# EAGLE design GBA_AIO_Matrix (EAGLE 6.6.0)

## Sheet 1 of 4
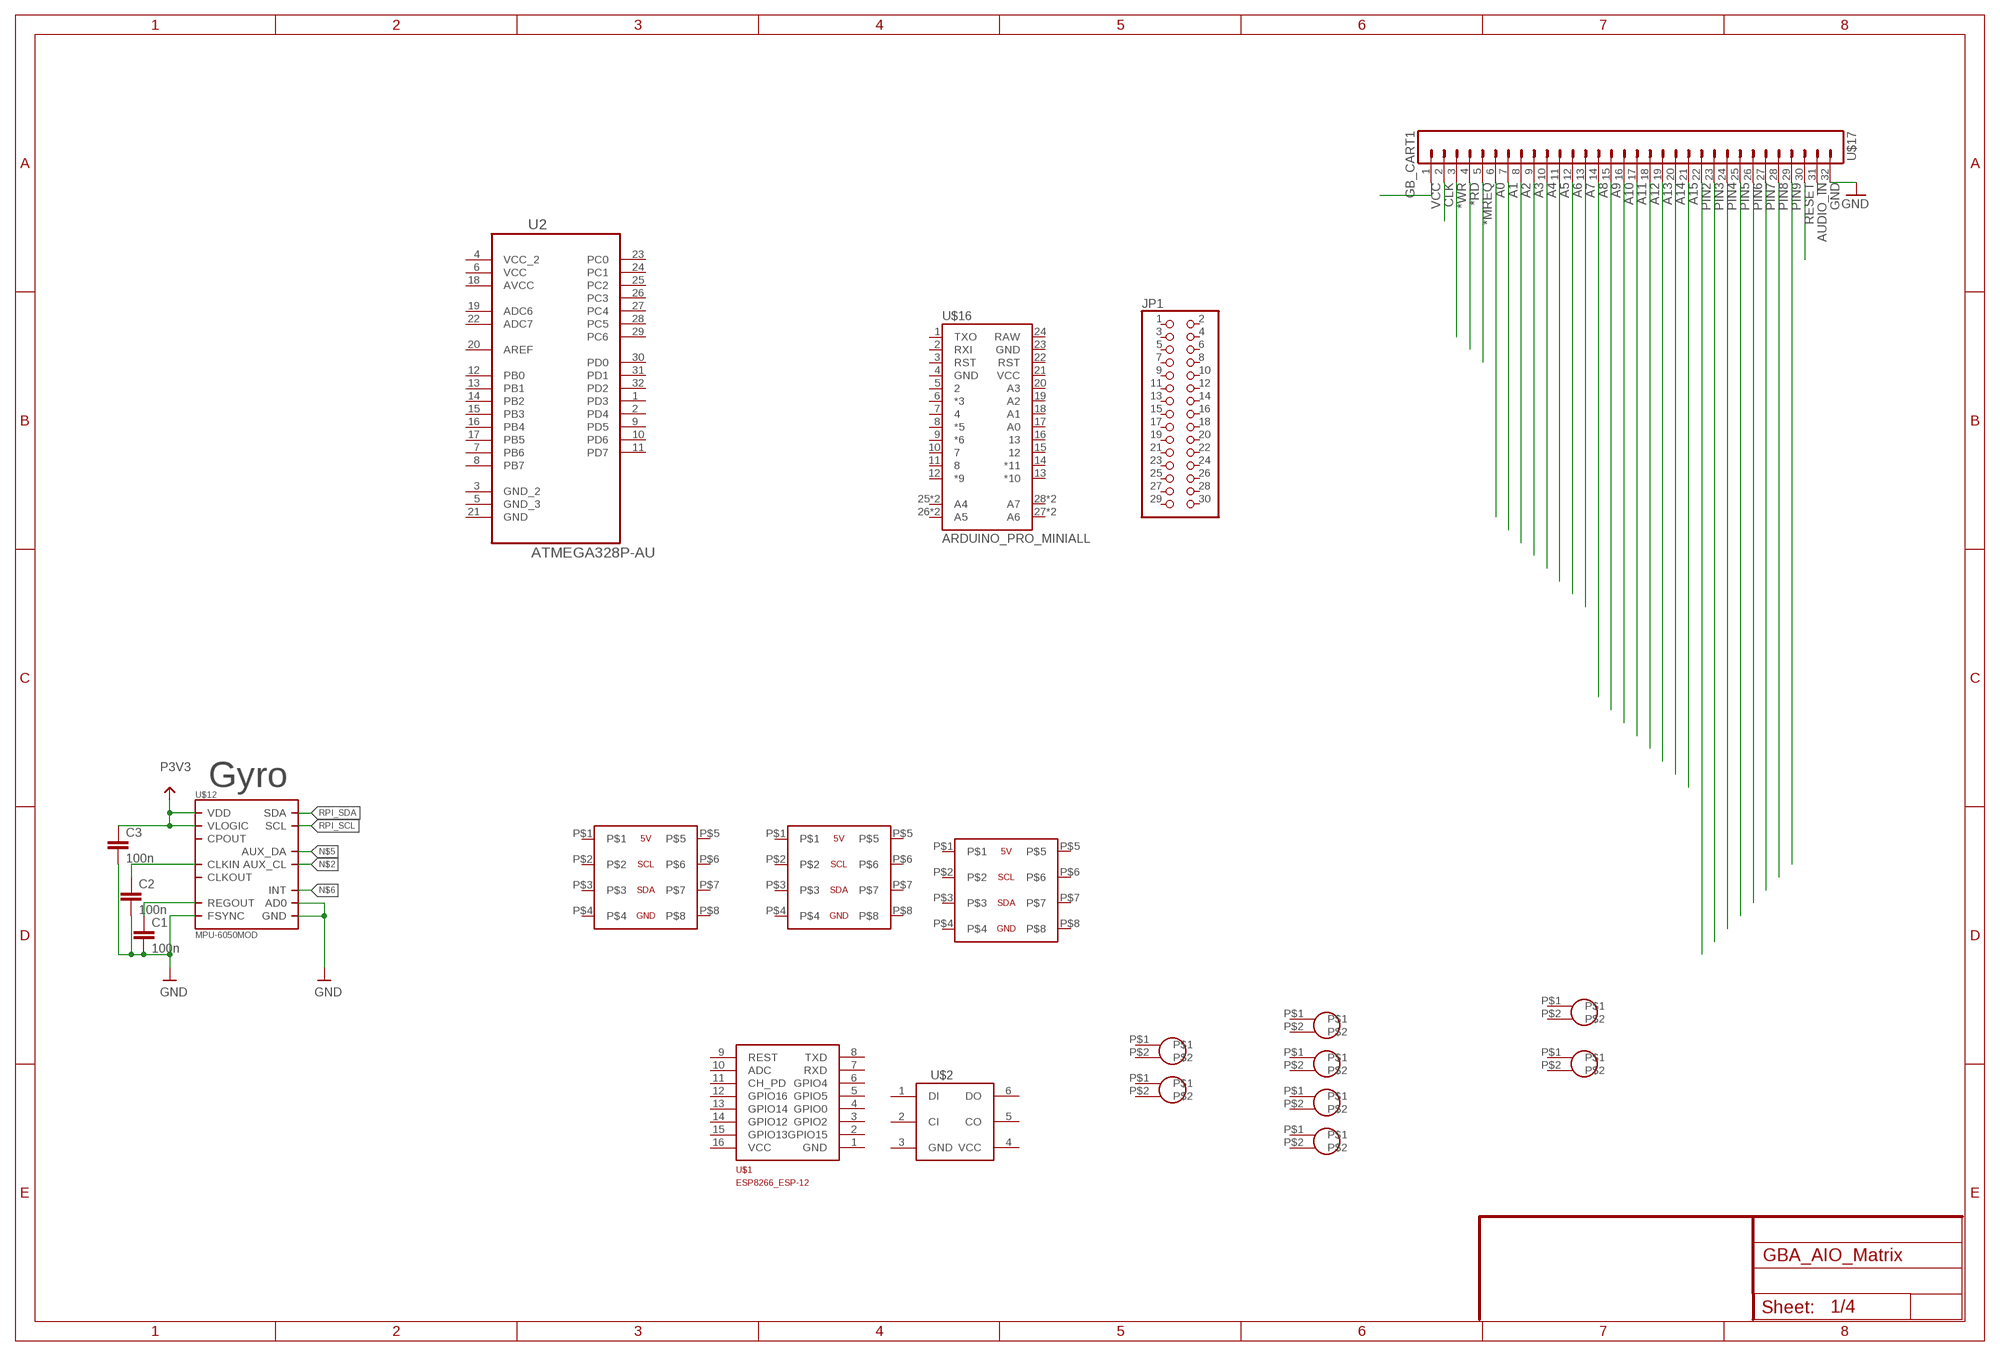
[diagram p0: schematic, sheet 1]

### Parts
C1  100n  C-EUC0603  [C0603]
C2  100n  C-EUC0603  [C0603]
C3  100n  C-EUC0603  [C0603]
JP1  PINHD-2X15/90  [2X15/90]
U2  ATMEGA328P-AU  [QFP80P900X900X120-32N]
U$1  ESP8266_ESP-12  [ESP8266-ESP12]
U$2  APA102  [LED5050]
U$4  GBA_BUTTONAB  [GBA_AB]
U$5  GBA_BUTTONAB  [GBA_AB]
U$6  GBA_BUTTONDIREKTION  [GBA_DIREKTION]
U$7  GBA_BUTTONDIREKTION  [GBA_DIREKTION]
U$8  GBA_BUTTONDIREKTION  [GBA_DIREKTION]
U$9  GBA_BUTTONDIREKTION  [GBA_DIREKTION]
U$10  GBA_BUTTONSTART  [GBA_START]
U$11  GBA_BUTTONSTART  [GBA_START]
U$12  MPU-6050MOD  [QFN.24.4X4.MOD]
U$16  ARDUINO_PRO_MINIALL  [ARDUINO_PRO_MINI]
U$17  GB_CART1  [GB_CART_1]
U$18  DEBAUER_18X6MATRIX  [DEBAUER_16X8MATRIX]
U$19  DEBAUER_18X6MATRIX  [DEBAUER_16X8MATRIX]
U$20  DEBAUER_18X6MATRIX  [DEBAUER_16X8MATRIX]

### Nets
*MREQ: U$17.5
*RD: U$17.4
*WR: U$17.3
A0: U$17.6 ; also sheet 4
A1: U$17.7 ; also sheet 4
A2: U$17.8 ; also sheet 4
A3: U$17.9
A4: U$17.10
A5: U$17.11
A6: U$17.12
A7: U$17.13
A8: U$17.14
A9: U$17.15
A10: U$17.16
A11: U$17.17
A12: U$17.18
A13: U$17.19
A14: U$17.20
A15: U$17.21
AUDIO_IN: U$17.31
GND: C1.2 C2.2 C3.2 U$12.9(AD0) U$12.11(FSYNC) U$12.18(GND) U$17.2 U$17.32 ; also sheet 2,3,4
N$1: C2.1 U$12.1(CLKIN)
N$2: U$12.7(AUX_CL)
N$3: C1.1 U$12.10(REGOUT)
N$5: U$12.6(AUX_DA)
N$6: U$12.12(INT)
P3V3: C3.1 U$12.8(VLOGIC) U$12.13(VDD) ; also sheet 2,3,4
PIN2: U$17.22
PIN3: U$17.23
PIN4: U$17.24
PIN5: U$17.25
PIN6: U$17.26
PIN7: U$17.27
PIN8: U$17.28
PIN9: U$17.29
RPI_SCL: U$12.23(SCL)
RPI_SDA: U$12.24(SDA)
VCC1: U$17.1 U$17.30
Unconnected: JP1.1 JP1.2 JP1.3 JP1.4 JP1.5 JP1.6 JP1.7 JP1.8 JP1.9 JP1.10 JP1.11 JP1.12 JP1.13 JP1.14 JP1.15 JP1.16 JP1.17 JP1.18 JP1.19 JP1.20 JP1.21 JP1.22 JP1.23 JP1.24 JP1.25 JP1.26 JP1.27 JP1.28 JP1.29 JP1.30 U2.1(PD3) U2.2(PD4) U2.3(GND_2) U2.5(GND_3) U2.7(PB6) U2.8(PB7) U2.9(PD5) U2.10(PD6) U2.11(PD7) U2.12(PB0) U2.13(PB1) U2.14(PB2) U2.15(PB3) U2.16(PB4) U2.17(PB5) U2.19(ADC6) U2.20(AREF) U2.21(GND) U2.22(ADC7) U2.23(PC0) U2.24(PC1) U2.25(PC2) U2.26(PC3) U2.27(PC4) U2.28(PC5) U2.29(PC6) U2.30(PD0) U2.31(PD1) U2.32(PD2) U$1.1(GND) U$1.2(GPIO15) U$1.3(GPIO2) U$1.4(GPIO0) U$1.5(GPIO5) U$1.6(GPIO4) U$1.7(RXD) U$1.8(TXD) U$1.9(REST) U$1.10(ADC) U$1.11(CH_PD) U$1.12(GPIO16) U$1.13(GPIO14) U$1.14(GPIO12) U$1.15(GPIO13) U$1.16(VCC) U$2.1(DI) U$2.2(CI) U$2.3(GND) U$2.4(VCC) U$2.5(CO) U$2.6(DO) U$4.P$1 U$4.P$2 U$5.P$1 U$5.P$2 U$6.P$1 U$6.P$2 U$7.P$1 U$7.P$2 U$8.P$1 U$8.P$2 U$9.P$1 U$9.P$2 U$10.P$1 U$10.P$2 U$11.P$1 U$11.P$2 U$12.20(CPOUT) U$12.22(CLKOUT) U$16.1(TXO) U$16.2(RXI) U$16.3(RST) U$16.4(GND) U$16.5 U$16.6(*3) U$16.7 U$16.8(*5) U$16.9(*6) U$16.10 U$16.11 U$16.12(*9) U$16.13(*10) U$16.14(*11) U$16.15 U$16.16 U$16.17(A0) U$16.18(A1) U$16.19(A2) U$16.20(A3) U$16.21(VCC) U$16.22(RST) U$16.23(GND) U$16.24(RAW) U$16.25(A4) U$16.26(A5) U$16.27(A6) U$16.28(A7) U$16.A4 U$16.A5 U$16.A6 U$16.A7 U$18.P$1 U$18.P$2 U$18.P$3 U$18.P$4 U$18.P$5 U$18.P$6 U$18.P$7 U$18.P$8 U$19.P$1 U$19.P$2 U$19.P$3 U$19.P$4 U$19.P$5 U$19.P$6 U$19.P$7 U$19.P$8 U$20.P$1 U$20.P$2 U$20.P$3 U$20.P$4 U$20.P$5 U$20.P$6 U$20.P$7 U$20.P$8

### Notes on the sheet
- VCC | CLK | RESET
- Gyro

## Sheet 2 of 4
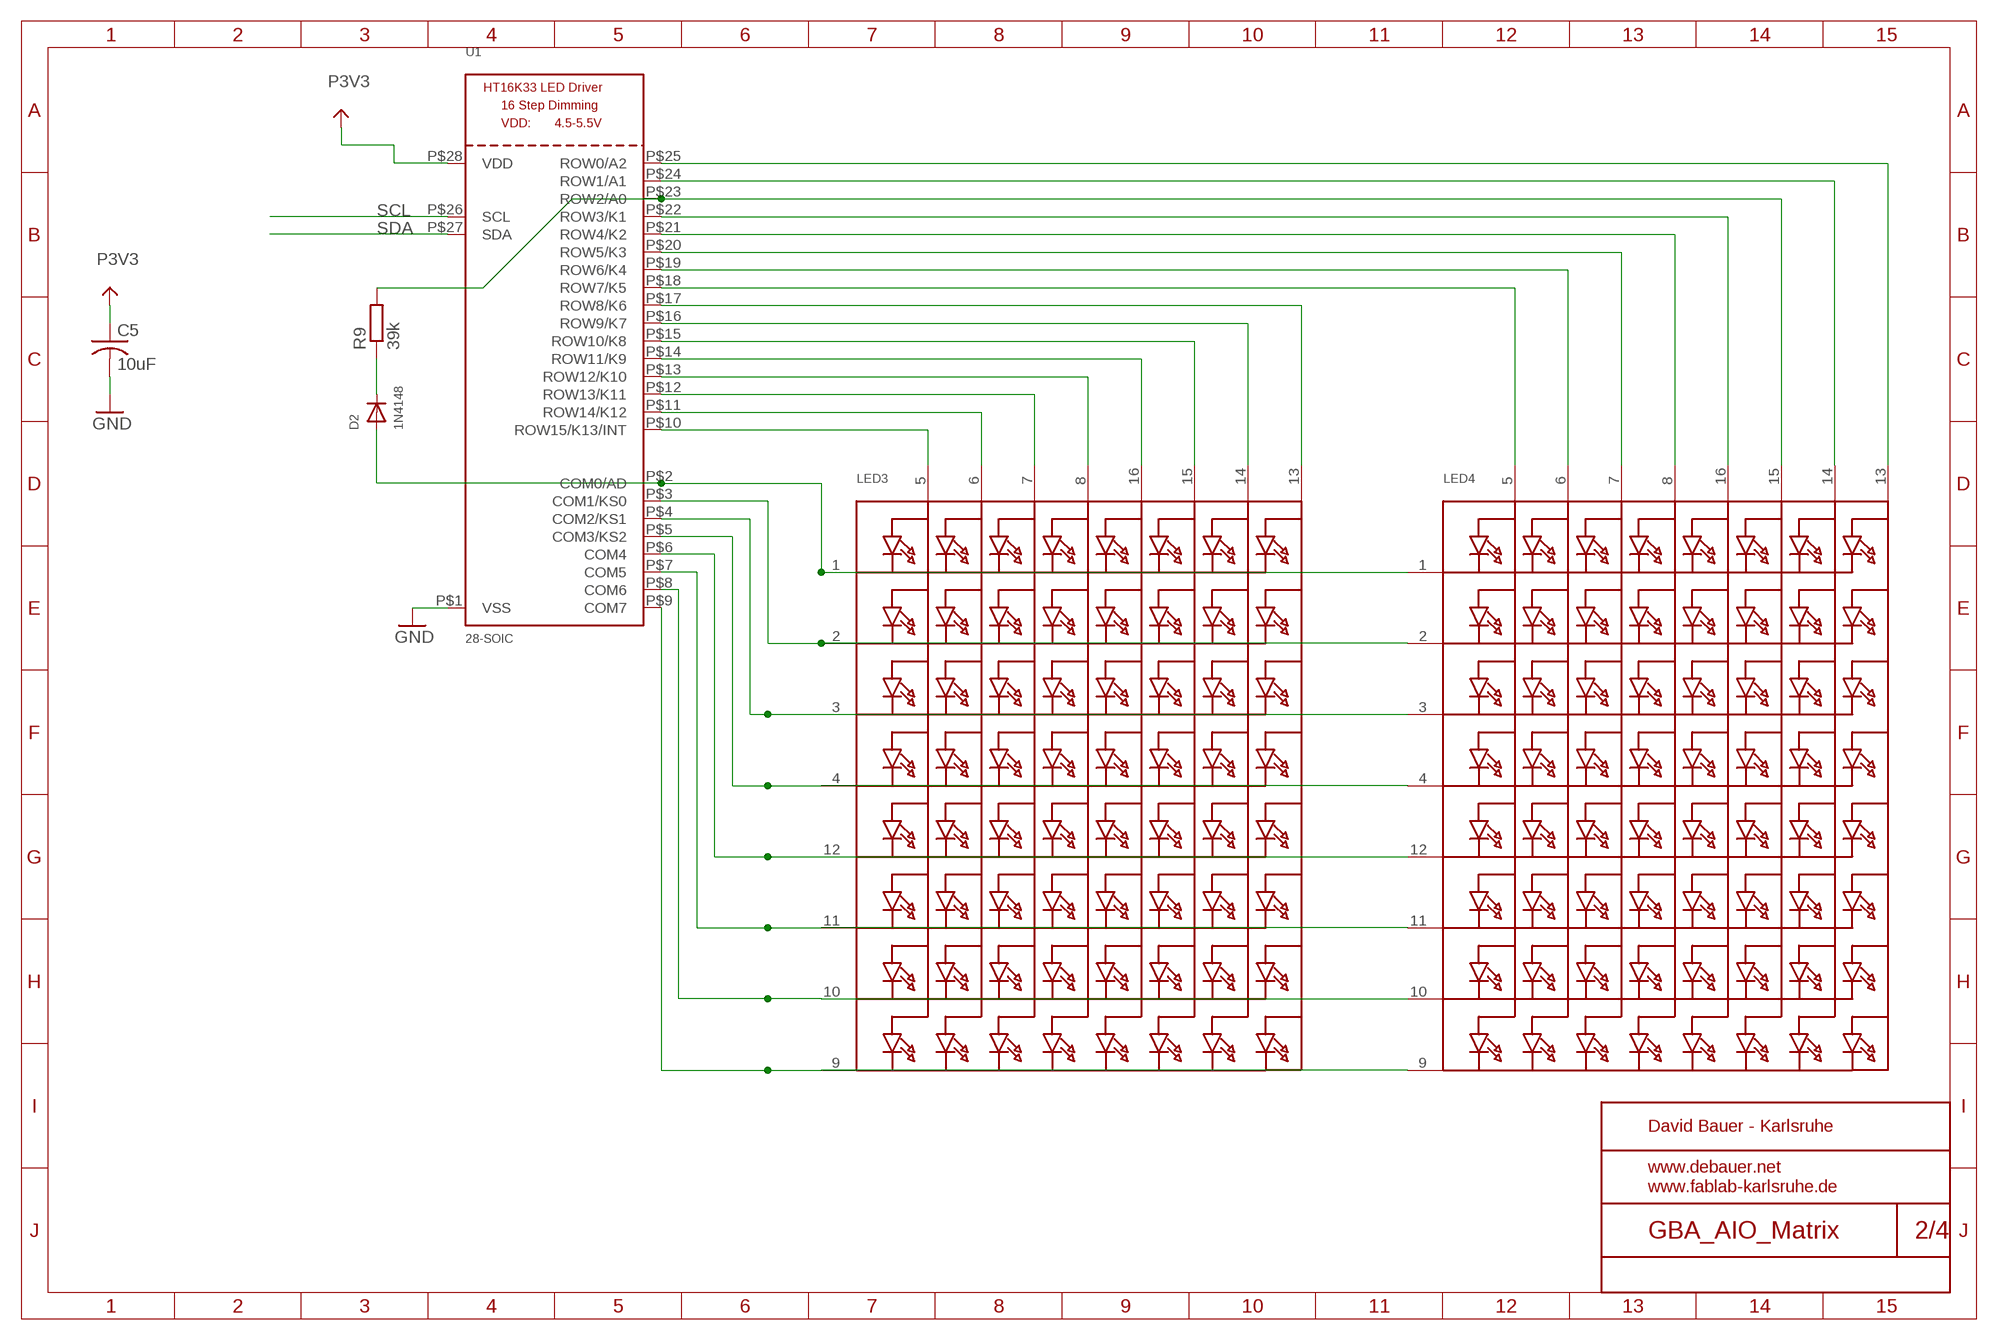
[diagram p1: schematic, sheet 2]

### Parts
C5  10uF  C-USC0805  [C0805]
D2  1N4148  DIODESOD-323F  [SOD-323F]
LED3  SEGMENT_8X8_ROWCATHODE  [SEGMENT_BL-M07C881UR]
LED4  SEGMENT_8X8_ROWCATHODE  [SEGMENT_BL-M07C881UR]
R9  39k  R-EU_R0805  [R0805]
U1  28-SOIC  HT16K33_SOP28  [SOP28_300MIL]

### Nets
GND: C5.2 U1.P$1(VSS) ; also sheet 1,3,4
N$4: LED4.13(A8) U1.P$25(ROW0/A2)
N$7: LED4.15(A6) R9.2 U1.P$23(ROW2/A0)
N$8: LED4.14(A7) U1.P$24(ROW1/A1)
N$12: LED3.9(K8) LED4.9(K8) U1.P$9(COM7)
N$13: LED3.10(K7) LED4.10(K7) U1.P$8(COM6)
N$21: LED3.11(K6) LED4.11(K6) U1.P$7(COM5)
N$24: LED3.12(K5) LED4.12(K5) U1.P$6(COM4)
N$25: LED3.4(K4) LED4.4(K4) U1.P$5(COM3/KS2)
N$27: LED3.3(K3) LED4.3(K3) U1.P$4(COM2/KS1)
N$30: LED3.6(A2) U1.P$11(ROW14/K12)
N$31: LED3.7(A3) U1.P$12(ROW13/K11)
N$32: LED4.5(A1) U1.P$18(ROW7/K5)
N$33: LED4.8(A4) U1.P$21(ROW4/K2)
N$34: LED4.7(A3) U1.P$20(ROW5/K3)
N$35: LED3.13(A8) U1.P$17(ROW8/K6)
N$36: LED3.14(A7) U1.P$16(ROW9/K7)
N$37: LED3.16(A5) U1.P$14(ROW11/K9)
N$43: LED3.15(A6) U1.P$15(ROW10/K8)
N$44: LED3.8(A4) U1.P$13(ROW12/K10)
N$45: LED3.5(A1) U1.P$10(ROW15/K13/INT)
N$47: D2.C R9.1
N$48: LED4.16(A5) U1.P$22(ROW3/K1)
N$49: LED4.6(A2) U1.P$19(ROW6/K4)
N$50: D2.A LED3.1(K1) LED4.1(K1) U1.P$2(COM0/AD)
N$55: LED3.2(K2) LED4.2(K2) U1.P$3(COM1/KS0)
P3V3: C5.1 U1.P$28(VDD) ; also sheet 1,3,4
SCL: U1.P$26(SCL) ; also sheet 3,4
SDA: U1.P$27(SDA) ; also sheet 3,4

## Sheet 3 of 4
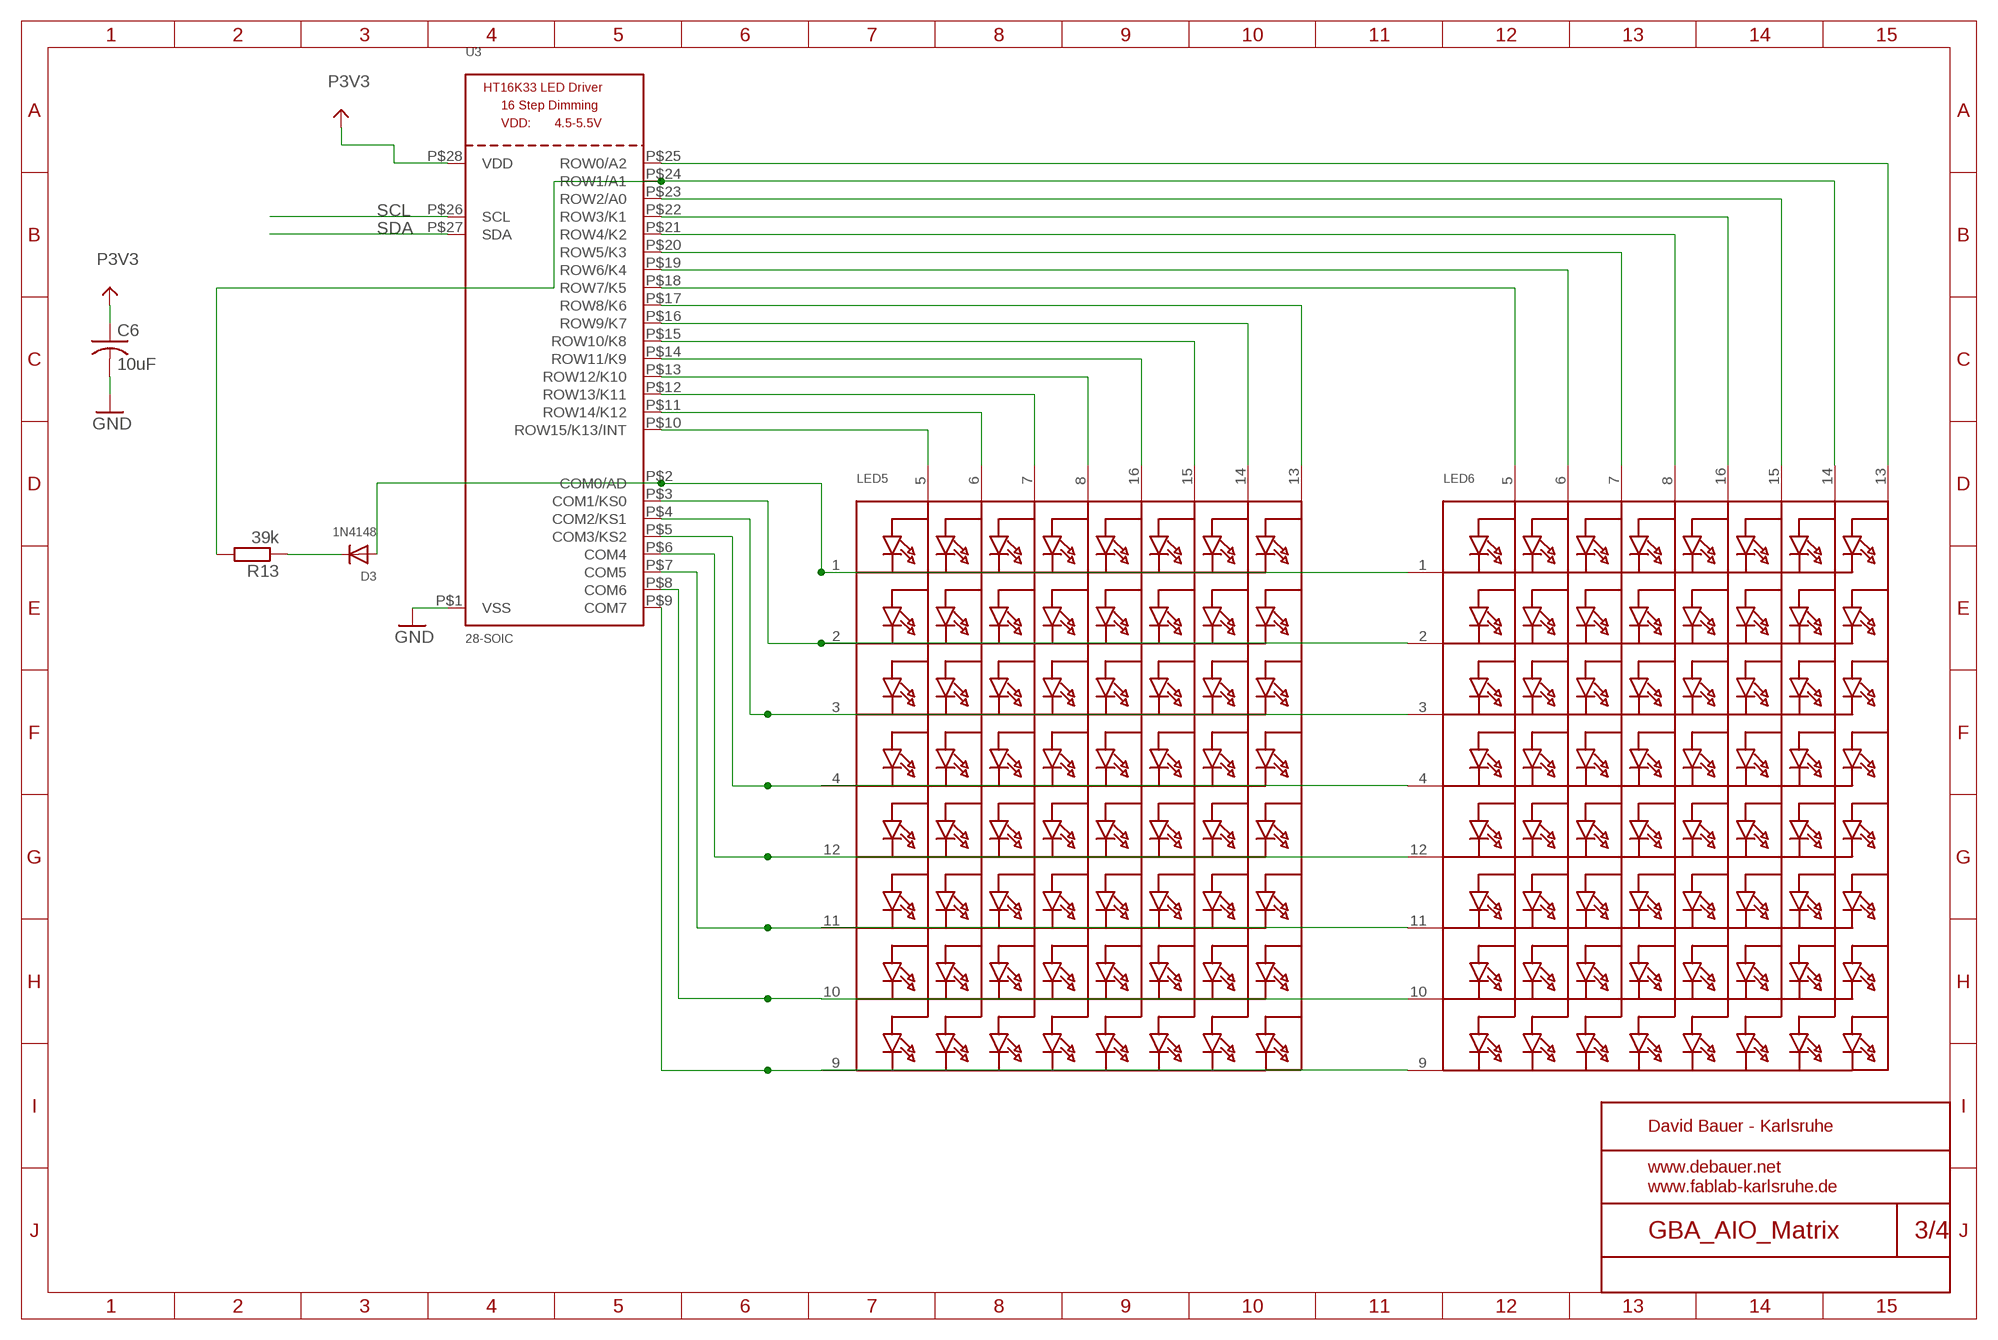
[diagram p2: schematic, sheet 3]

### Parts
C6  10uF  C-USC0805  [C0805]
D3  1N4148  DIODESOD-323F  [SOD-323F]
LED5  SEGMENT_8X8_ROWCATHODE  [SEGMENT_BL-M07C881UR]
LED6  SEGMENT_8X8_ROWCATHODE  [SEGMENT_BL-M07C881UR]
R13  39k  R-EU_R0805  [R0805]
U3  28-SOIC  HT16K33_SOP28  [SOP28_300MIL]

### Nets
GND: C6.2 U3.P$1(VSS) ; also sheet 1,2,4
N$9: LED6.13(A8) U3.P$25(ROW0/A2)
N$10: LED6.14(A7) R13.2 U3.P$24(ROW1/A1)
N$11: LED6.15(A6) U3.P$23(ROW2/A0)
N$56: LED5.9(K8) LED6.9(K8) U3.P$9(COM7)
N$57: LED5.10(K7) LED6.10(K7) U3.P$8(COM6)
N$58: LED5.11(K6) LED6.11(K6) U3.P$7(COM5)
N$59: LED5.12(K5) LED6.12(K5) U3.P$6(COM4)
N$60: LED5.4(K4) LED6.4(K4) U3.P$5(COM3/KS2)
N$61: LED5.3(K3) LED6.3(K3) U3.P$4(COM2/KS1)
N$64: LED5.6(A2) U3.P$11(ROW14/K12)
N$65: LED5.7(A3) U3.P$12(ROW13/K11)
N$66: LED6.5(A1) U3.P$18(ROW7/K5)
N$67: LED6.8(A4) U3.P$21(ROW4/K2)
N$68: LED6.7(A3) U3.P$20(ROW5/K3)
N$69: LED5.13(A8) U3.P$17(ROW8/K6)
N$70: LED5.14(A7) U3.P$16(ROW9/K7)
N$71: LED5.16(A5) U3.P$14(ROW11/K9)
N$72: LED5.15(A6) U3.P$15(ROW10/K8)
N$73: LED5.8(A4) U3.P$13(ROW12/K10)
N$74: LED5.5(A1) U3.P$10(ROW15/K13/INT)
N$76: D3.C R13.1
N$77: LED6.16(A5) U3.P$22(ROW3/K1)
N$78: LED6.6(A2) U3.P$19(ROW6/K4)
N$79: D3.A LED5.1(K1) LED6.1(K1) U3.P$2(COM0/AD)
N$80: LED5.2(K2) LED6.2(K2) U3.P$3(COM1/KS0)
P3V3: C6.1 U3.P$28(VDD) ; also sheet 1,2,4
SCL: U3.P$26(SCL) ; also sheet 2,4
SDA: U3.P$27(SDA) ; also sheet 2,4

## Sheet 4 of 4
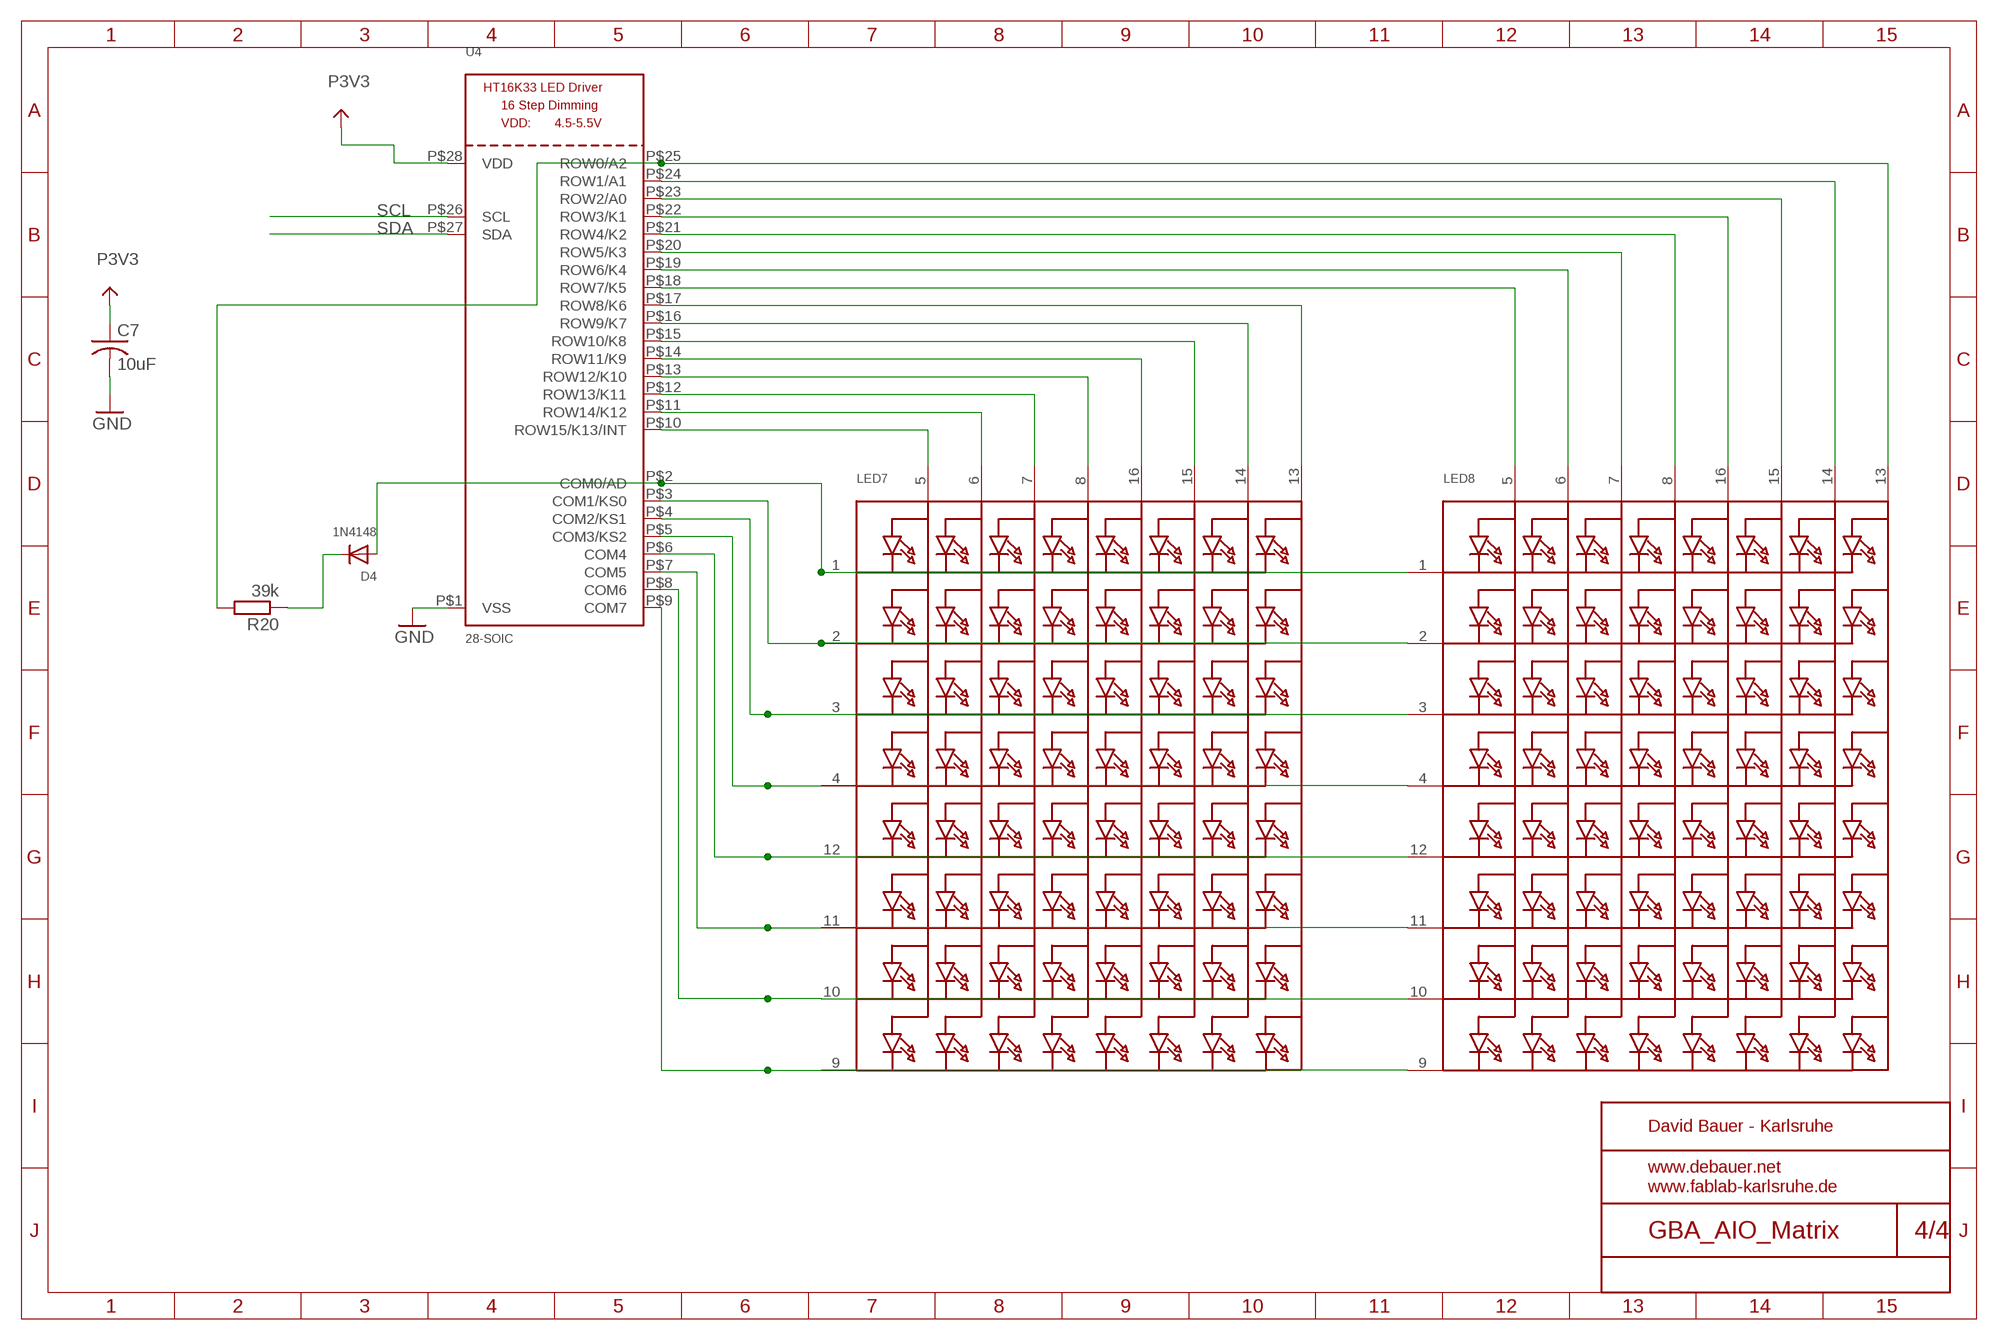
[diagram p3: schematic, sheet 4]

### Parts
C7  10uF  C-USC0805  [C0805]
D4  1N4148  DIODESOD-323F  [SOD-323F]
LED7  SEGMENT_8X8_ROWCATHODE  [SEGMENT_BL-M07C881UR]
LED8  SEGMENT_8X8_ROWCATHODE  [SEGMENT_BL-M07C881UR]
R20  39k  R-EU_R0805  [R0805]
U4  28-SOIC  HT16K33_SOP28  [SOP28_300MIL]

### Nets
A0: LED8.15(A6) U4.P$23(ROW2/A0) ; also sheet 1
A1: LED8.14(A7) U4.P$24(ROW1/A1) ; also sheet 1
A2: LED8.13(A8) R20.2 U4.P$25(ROW0/A2) ; also sheet 1
GND: C7.2 U4.P$1(VSS) ; also sheet 1,2,3
N$81: LED7.9(K8) LED8.9(K8) U4.P$9(COM7)
N$82: LED7.10(K7) LED8.10(K7) U4.P$8(COM6)
N$83: LED7.11(K6) LED8.11(K6) U4.P$7(COM5)
N$84: LED7.12(K5) LED8.12(K5) U4.P$6(COM4)
N$85: LED7.4(K4) LED8.4(K4) U4.P$5(COM3/KS2)
N$86: LED7.3(K3) LED8.3(K3) U4.P$4(COM2/KS1)
N$89: LED7.6(A2) U4.P$11(ROW14/K12)
N$90: LED7.7(A3) U4.P$12(ROW13/K11)
N$91: LED8.5(A1) U4.P$18(ROW7/K5)
N$92: LED8.8(A4) U4.P$21(ROW4/K2)
N$93: LED8.7(A3) U4.P$20(ROW5/K3)
N$94: LED7.13(A8) U4.P$17(ROW8/K6)
N$95: LED7.14(A7) U4.P$16(ROW9/K7)
N$96: LED7.16(A5) U4.P$14(ROW11/K9)
N$97: LED7.15(A6) U4.P$15(ROW10/K8)
N$98: LED7.8(A4) U4.P$13(ROW12/K10)
N$99: LED7.5(A1) U4.P$10(ROW15/K13/INT)
N$101: D4.C R20.1
N$102: LED8.16(A5) U4.P$22(ROW3/K1)
N$103: LED8.6(A2) U4.P$19(ROW6/K4)
N$104: D4.A LED7.1(K1) LED8.1(K1) U4.P$2(COM0/AD)
N$105: LED7.2(K2) LED8.2(K2) U4.P$3(COM1/KS0)
P3V3: C7.1 U4.P$28(VDD) ; also sheet 1,2,3
SCL: U4.P$26(SCL) ; also sheet 2,3
SDA: U4.P$27(SDA) ; also sheet 2,3

## Power pins joined to a net without a drawn wire
AVCC: U2.18(AVCC)
VCC: U2.6(VCC)
VCC_2: U2.4(VCC_2)

## Library data of the parts
C1-C3 = debauer_passiv:C-EU: CAPACITOR, European symbol
C5-C7 = rcl:C-US: CAPACITOR, American symbol
D2-D4 = adafruit:DIODE: Diode SMADIODE - SMA Surface Mount Package 20V 1A Schottky Diode Digikey: 641-1014-6-ND DO-1N4148 - Through Hole Small Current Diode SOD-123 20V 1 A (.5mV Vf) Schottky Diode - Digikey: MBRX120TPMSCT-ND SOD-323 10V 570mA (.38mV Vf, 3ns) Schottky Diode - Digikey: ZLLS410CT-ND SOD-523 30V 30mA Schottky Diode (RB751S-40TE61) - Digikey: RB751S-40TE61CT-ND SOT23-R/W - SOT23 Package (R = Solder Paste/Reflow Ovens, W = Hand-Soldering) BAT54Film 40V 300mA - Digikey: 497-7162-1-ND
JP1 = pinhead:PINHD-2X15: PIN HEADER
LED3-LED8 = adafruit:SEGMENT_8X8_ROWCATHODE: 8x8 LED Segment Displays: Row = Cathode 0.7" Red 8X8 Matrix, 1.9mm Round LEDs - BL-M07C881UR 1.2" Red 8x8 Matrix, 3.0mm Round LEDs - BL-M12A881UR 1.2" Red 8x8 Matrix, 3.0mm Square LEDs - BL-M12A883
R9 R13 R20 = debauer_passiv:R-EU_: RESISTOR, European symbol
U1 U3 U4 = microbuilder:HT16K33_SOP28
U2 = Atmel_ics:ATMEGA328P-AU: 8-bit Microcontroller with In-System Programmable Flash; MPN: ATMEGA328P-AU; OC_FARNELL: 1715486; OC_NEWARK: 14R4631; PACKAGE: TQFP-32; SUPPLIER: Atmel
U$1 = debauer_modules:ESP8266_ESP-12
U$2 = debauer_led:APA102
U$4-U$11 = debauer_button:GBA_BUTTON
U$12 = debauer_ics:MPU-6050
U$16 = debauer_modules:ARDUINO_PRO_MINI
U$17 = alex:GB_CART
U$18-U$20 = debauer_modules:DEBAUER_18X6MATRIX

## Net classes
2 gnd: width 0.254 mm, drill 0.254 mm, clearance 0.178 mm
3 usbvcc: width 0.203 mm, drill 0.406 mm, clearance 0.178 mm
4 USBpair: width 0.254 mm, drill 0.406 mm, clearance 0.508 mm

## Board
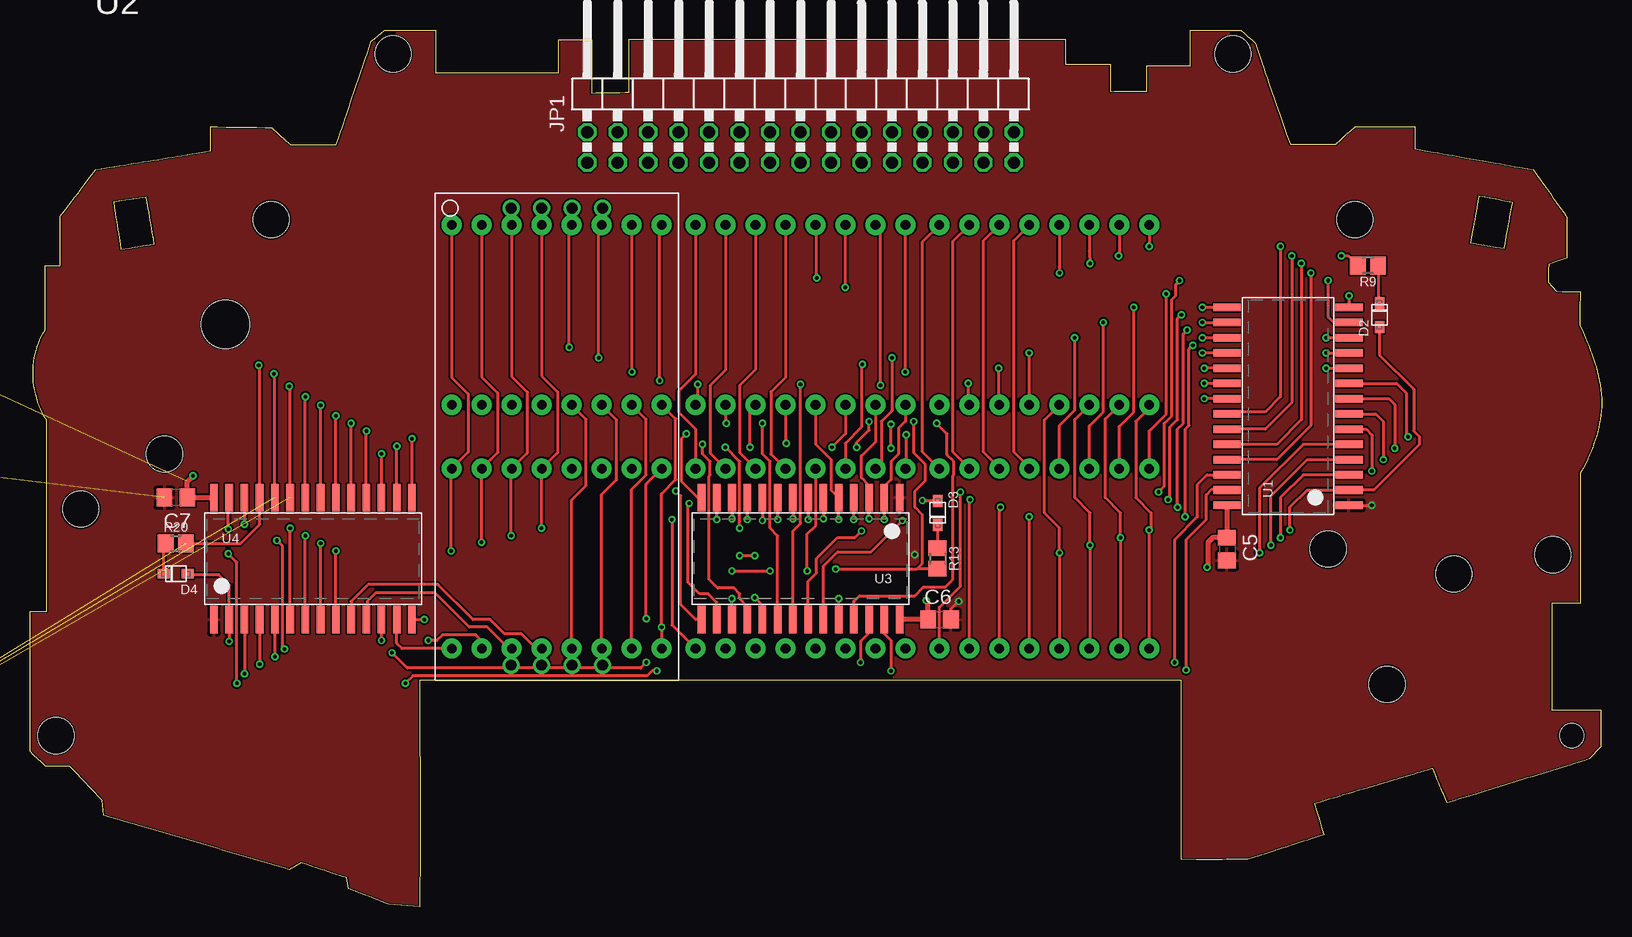
[diagram p4: board, top side]
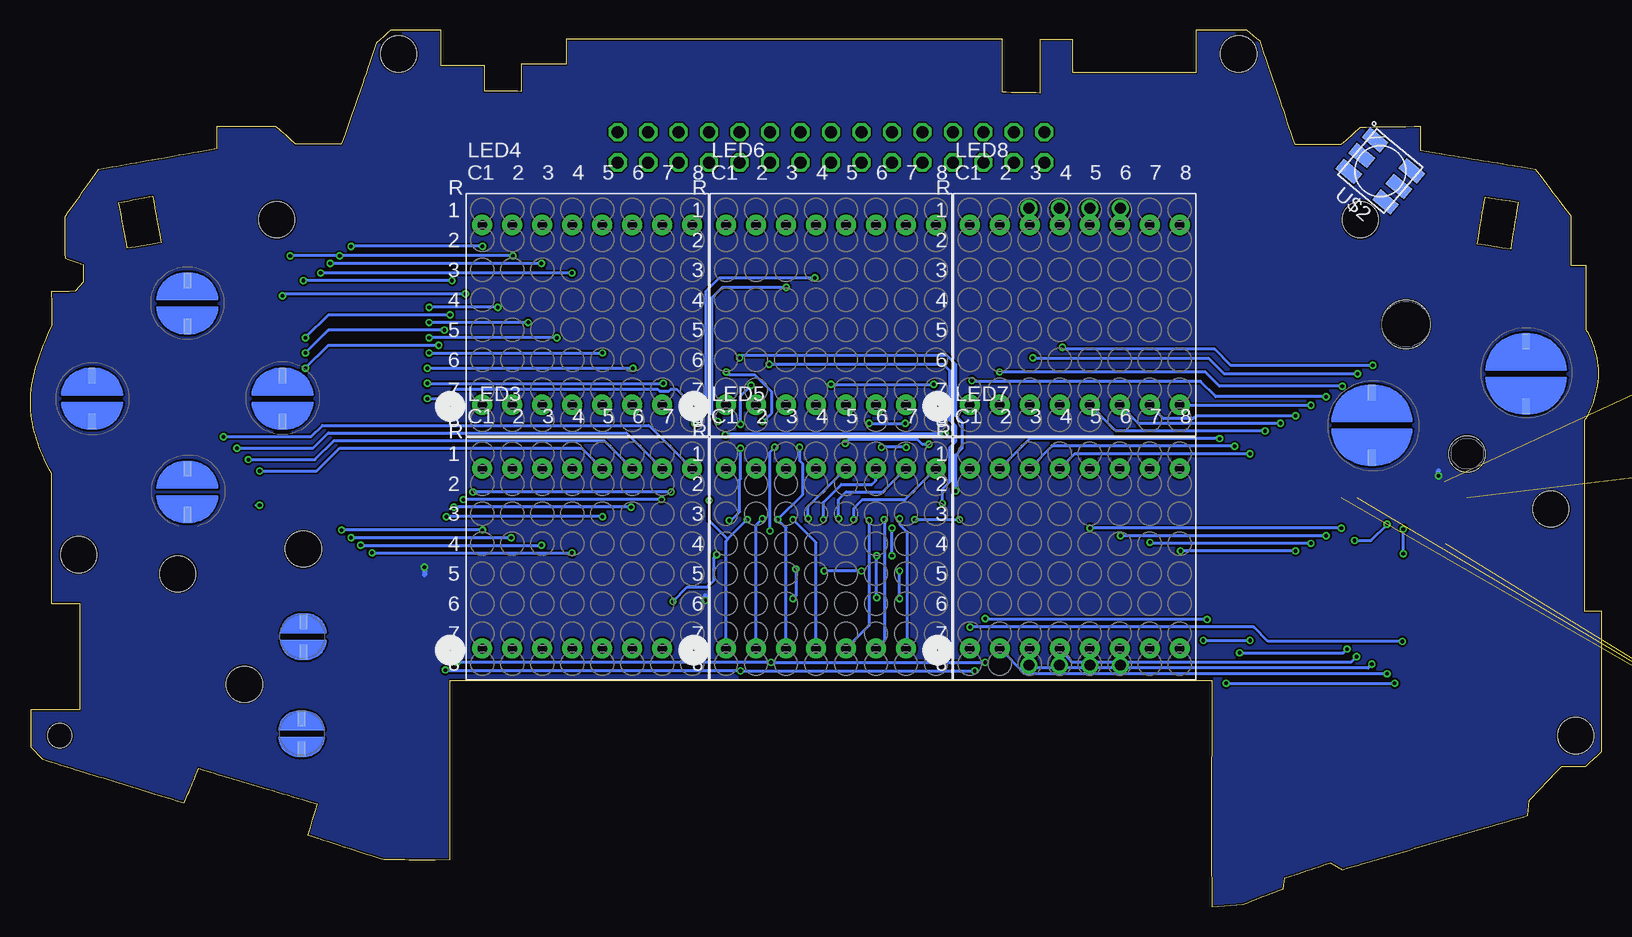
[diagram p5: board, bottom side, seen from below]

Size 131 x 73.12 mm. Coordinates in mm from the lower left corner, seen from the top.
Outline: 499 segments
Copper layers (1*16): Top 0.035mm / dielectric 1.5mm / Bottom 0.035mm
Design rules "ITEADstudio_DRC *": minimum track width 6mil, minimum drill 12mil, track to track 6mil, track to pad 6mil, pad to pad 6mil, via to via 6mil, smd to smd 0mil, copper to edge 6mil, drill to drill 6mil, minimum pad ring 10mil, minimum via ring 6mil, stop-mask expansion 2mil, vias tented up to drill 100mil, thermal gap 10mil
Holes 3 mm at 126.94,29.37 118.68,27.78 108.2,29.84 110.43,57.31 100.27,71.12 30.26,71.12 20.1,57.31 11.21,37.78 4.22,33.18 2.16,14.29 113.13,18.57
Holes 2 mm at 128.52,14.29
Holes 4 mm at 16.29,48.58
tKeepout: area 112,36.7 to 124,48.7; area 3.4,41.6 to 9.1,47.3; area 16.3,37.3 to 22,43; area 33.8,48.1 to 37.6,57
bKeepout: area 104.6,29.2 to 130.6,55.2; area 104.9,11.1 to 111.7,26.5; area 102.3,6.2 to 106.1,63.3; area 24.9,63.3 to 106.1,73.5; area 104.9,46.8 to 130.3,67.2; area -0.5,-1.4 to 27.4,65.9

### Footprints (pad centres in the part's own frame; a part is rotated, then mirrored left to right if it is on the bottom)
C0603 = smd 1.1 x 1: 1 -0.85,0; 2 0.85,0
C0805 = smd 1.3 x 1.5: 1 -0.95,0; 2 0.95,0
SOD-323F = smd 1 x 0.8: A -1,0; C 1,0
2X15/90 = drill 1.016 octagon: 1 -17.78,-6.35; 2 -17.78,-3.81; 3 -15.24,-6.35; 4 -15.24,-3.81; 5 -12.7,-6.35; 6 -12.7,-3.81; 7 -10.16,-6.35; 8 -10.16,-3.81; 9 -7.62,-6.35; 10 -7.62,-3.81; 11 -5.08,-6.35; 12 -5.08,-3.81; 13 -2.54,-6.35; 14 -2.54,-3.81; 15 0,-6.35; 16 0,-3.81; 17 2.54,-6.35; 18 2.54,-3.81; 19 5.08,-6.35; 20 5.08,-3.81; 21 7.62,-6.35; 22 7.62,-3.81; 23 10.16,-6.35; 24 10.16,-3.81; 25 12.7,-6.35; 26 12.7,-3.81; 27 15.24,-6.35; 28 15.24,-3.81; 29 17.78,-6.35; 30 17.78,-3.81
SEGMENT_BL-M07C881UR = drill 0.8 pad 1.676: 1 -8.75,-7.5; 2 -6.25,-7.5; 3 -3.75,-7.5; 4 -1.25,-7.5; 5 1.25,-7.5; 6 3.75,-7.5; 7 6.25,-7.5; 8 8.75,-7.5; 9 8.75,7.5; 10 6.25,7.5; 11 3.75,7.5; 12 1.25,7.5; 13 -1.25,7.5; 14 -3.75,7.5; 15 -6.25,7.5; 16 -8.75,7.5
R0805 = smd 1.3 x 1.5: 1 -0.85,0; 2 0.85,0
SOP28_300MIL = smd 0.635 x 2.286: P$1 -8.255,-5.08; P$2 -6.985,-5.08; P$3 -5.715,-5.08; P$4 -4.445,-5.08; P$5 -3.175,-5.08; P$6 -1.905,-5.08; P$7 -0.635,-5.08; P$8 0.635,-5.08; P$9 1.905,-5.08; P$10 3.175,-5.08; P$11 4.445,-5.08; P$12 5.715,-5.08; P$13 6.985,-5.08; P$14 8.255,-5.08; P$15 8.255,5.08; P$16 6.985,5.08; P$17 5.715,5.08; P$18 4.445,5.08; P$19 3.175,5.08; P$20 1.905,5.08; P$21 0.635,5.08; P$22 -0.635,5.08; P$23 -1.905,5.08; P$24 -3.175,5.08; P$25 -4.445,5.08; P$26 -5.715,5.08; P$27 -6.985,5.08; P$28 -8.255,5.08
QFP80P900X900X120-32N = smd 1.473 x 0.508: 1 -4.115,2.794; 2 -4.115,2.007; 3 -4.115,1.194; 4 -4.115,0.406; 5 -4.115,-0.406; 6 -4.115,-1.194; 7 -4.115,-2.007; 8 -4.115,-2.794; 17 4.115,-2.794; 18 4.115,-2.007; 19 4.115,-1.194; 20 4.115,-0.406; 21 4.115,0.406; 22 4.115,1.194; 23 4.115,2.007; 24 4.115,2.794 | smd 0.508 x 1.473: 9 -2.794,-4.115; 10 -2.007,-4.115; 11 -1.194,-4.115; 12 -0.406,-4.115; 13 0.406,-4.115; 14 1.194,-4.115; 15 2.007,-4.115; 16 2.794,-4.115; 25 2.794,4.115; 26 2.007,4.115; 27 1.194,4.115; 28 0.406,4.115; 29 -0.406,4.115; 30 -1.194,4.115; 31 -2.007,4.115; 32 -2.794,4.115
ESP8266-ESP12 = smd 2 x 1.2: 1 16.2,2; 2 16.2,4; 3 16.2,6; 4 16.2,8; 5 16.2,10; 6 16.2,12; 7 16.2,14; 8 16.2,16; 9 0,16; 10 0,14; 11 0,12; 12 0,10; 13 0,8; 14 0,6; 15 0,4; 16 0,2
LED5050 = smd 2 x 1.1: 1 -2,1.7; 2 -2,0; 3 -2,-1.7; 4 2,-1.7; 5 2,0; 6 2,1.7
GBA_AB = smd 0.635 x 1.27: P$1 0,-2.715; P$2 0,2.715
GBA_DIREKTION = smd 0.635 x 1.27: P$1 0,-1.905; P$2 0,1.905
GBA_START = smd 0.635 x 1.27: P$1 0,-1.27; P$2 0,1.27
QFN.24.4X4.MOD = smd 0.838 x 0.305: 1 -1.975,1.25; 2 -1.975,0.75; 3 -1.975,0.25; 4 -1.975,-0.25; 5 -1.975,-0.75; 6 -1.975,-1.25; 13 1.975,-1.25; 14 1.975,-0.75; 15 1.975,-0.25; 16 1.975,0.25; 17 1.975,0.75; 18 1.975,1.25 | smd 0.305 x 0.838: 7 -1.25,-1.975; 8 -0.75,-1.975; 9 -0.25,-1.975; 10 0.25,-1.975; 11 0.75,-1.975; 12 1.25,-1.975; 19 1.25,1.975; 20 0.75,1.975; 21 0.25,1.975; 22 -0.25,1.975; 23 -0.75,1.975; 24 -1.25,1.975
ARDUINO_PRO_MINI = drill 1.016 pad 1.88: 1 -7.62,12.7; 2 -7.62,10.16; 3 -7.62,7.62; 4 -7.62,5.08; 5 -7.62,2.54; 6 -7.62,0; 7 -7.62,-2.54; 8 -7.62,-5.08; 9 -7.62,-7.62; 10 -7.62,-10.16; 11 -7.62,-12.7; 12 -7.62,-15.24; 13 7.62,-15.24; 14 7.62,-12.7; 15 7.62,-10.16; 16 7.62,-7.62; 17 7.62,-5.08; 18 7.62,-2.54; 19 7.62,0; 20 7.62,2.54; 21 7.62,5.08; 22 7.62,7.62; 23 7.62,10.16; 24 7.62,12.7; 25 -3.81,-15.24; 26 -1.27,-15.24; 27 1.27,-15.24; 28 3.81,-15.24; A4 4.763,1.429; A5 4.763,3.969; A6 4.763,-9.049; A7 4.763,-6.509; BLK -6.35,15.24; GND -3.81,15.24; GRN 6.35,15.24; RXI 1.27,15.24; TXO 3.81,15.24; VCC -1.27,15.24
GB_CART_1 = smd 1.36 x 3.46: 1 -22.895,-0.12; 32 23.94,-0.12 | smd 1.03 x 3.46: 2 -21.225,-0.12; 3 -19.725,-0.12; 4 -18.225,-0.12; 5 -16.725,-0.12; 6 -15.225,-0.12; 7 -13.725,-0.12; 8 -12.225,-0.12; 9 -10.725,-0.12; 10 -9.225,-0.12; 11 -7.725,-0.12; 12 -6.225,-0.12; 13 -4.725,-0.12; 14 -3.225,-0.12; 15 -1.725,-0.12; 16 -0.225,-0.12; 17 1.275,-0.12; 18 2.775,-0.12; 19 4.275,-0.12; 20 5.775,-0.12; 21 7.275,-0.12; 22 8.775,-0.12; 23 10.275,-0.12; 24 11.775,-0.12; 25 13.275,-0.12; 26 14.775,-0.12; 27 16.275,-0.12; 28 17.775,-0.12; 29 19.275,-0.12; 30 20.775,-0.12; 31 22.275,-0.12
DEBAUER_16X8MATRIX = drill 0.9: P$1 6.35,39.37; P$3 11.43,39.37; P$4 13.97,39.37; P$5 6.35,1.27; P$6 8.89,1.27; P$7 11.43,1.27; P$8 13.97,1.27 | drill 0.9 pad 1.422: P$2 8.89,39.37

### Placement (x,y rotation side)
C1  -10.7,41.75 0 top  (outside the outline)
C2  -10.7,51.91 0 top  (outside the outline)
C3  -10.7,36.67 0 top  (outside the outline)
C5  99.79,29.84 270 top
C6  75.82,23.97 0 top
C7  12.16,34.13 180 top
D2  112.49,49.37 90 top
D3  75.66,32.86 270 top
D4  12.16,27.78 180 top
JP1  64.23,68.42 0 top
LED3  84.55,29.05 0 bottom
LED4  84.55,49.37 0 bottom
LED5  64.23,29.05 0 bottom
LED6  64.23,49.37 0 bottom
LED7  43.91,29.05 0 bottom
LED8  43.91,49.37 0 bottom
R9  111.54,53.5 180 top
R13  75.66,29.05 270 top
R20  12.16,30.32 0 top
U1  104.87,41.75 90 top
U2  10.89,82.39 0 top  (outside the outline)
U3  64.23,29.05 180 top
U4  23.59,29.05 0 top
U$1  -20.86,58.26 0 top  (outside the outline)
U$2  18.44,61.36 140 bottom
U$4  6.29,44.45 0 bottom
U$5  19.15,40.16 0 bottom
U$6  117.89,34.61 0 bottom
U$7  109.95,42.39 0 bottom
U$8  117.89,50.32 0 bottom
U$9  125.83,42.39 0 bottom
U$10  108.2,22.54 0 bottom
U$11  108.36,14.45 0 bottom
U$12  -10.7,46.83 0 top  (outside the outline)
U$16  -14.51,15.08 0 top  (outside the outline)
U$17  -51.34,-16.67 0 top  (outside the outline)
U$18  33.75,18.89 0 top
U$19  -117.38,-20.48 0 top  (outside the outline)
U$20  -138.97,-20.48 0 top  (outside the outline)

### Tracks (layer width: path | path; a pad name or v marks a point on that pad's centre or on a via)
A0  (via drill 0.3)  (1 unrouted)
  Top 0.254: U4.P$23 21.69,43.34 v21.61,43.42 | v50.18,44.61 50.18,56.85 LED8.15
  Bottom 0.254: v21.61,43.42 31.85,43.42 33.04,44.61 v50.18,44.61
A1  (via drill 0.3)  (1 unrouted)
  Top 0.254: U4.P$24 20.42,44.37 v20.34,44.45 | v47.4,45.8 47.4,56.61 LED8.14
  Bottom 0.254: v20.34,44.45 31.45,44.45 32.72,45.72 47.32,45.72 v47.4,45.8 | 47.4,56.61 LED8.14
A2  (via drill 0.3)  (1 unrouted)
  Top 0.254: v19.07,45.16 19.15,45.09 U4.P$25 19.15,31.91 17.56,30.32 R20.2 | v44.94,46.67 44.94,56.65 LED8.13
  Bottom 0.254: v19.07,45.16 30.89,45.16 32.24,46.51 44.78,46.51 v44.94,46.67
GND  (via drill 0.3)  (8 unrouted)
  Top 0.254: U1.P$1 v111.86,33.5 | C6.2 76.77,24.84 v77.41,25.48 | v73.76,29.37 73.76,29.61
  Bottom 0.254: v111.86,33.5 112.17,33.5 | v77.41,25.48 76.22,26.67 74.55,26.67 73.99,27.23 73.99,29.13 v73.76,29.37
  pour Top: -1.81,76.04 132.81,76.04 132.81,-2.7 -1.81,-2.7
N$1  (1 unrouted)
N$3  (1 unrouted)
N$4  (via drill 0.3)
  Top 0.254: LED4.13 85.8,53.36 v85.82,52.86 | v106.78,52.86 106.78,40.16 103.92,37.31 U1.P$25
  Bottom 0.254: v85.82,52.86 v106.78,52.86
N$7  (via drill 0.3)
  Top 0.254: LED4.15 90.8,54.35 v90.74,54.29 | v105.19,54.29 105.19,42.07 102.97,39.85 U1.P$23 | v109.32,54.29 109.89,54.29 R9.2
  Bottom 0.254: v90.74,54.29 v105.19,54.29 v109.32,54.29
N$8  (via drill 0.3)
  Top 0.254: LED4.14 88.3,54.67 v88.36,53.66 | v105.98,53.66 105.98,40.64 103.92,38.58 U1.P$24
  Bottom 0.254: v88.36,53.66 v105.98,53.66
N$9  (via drill 0.3)
  Top 0.254: U3.P$25 68.68,25.48 69.15,25.96 73.76,25.96 74.47,26.67 76.3,26.67 76.93,27.31 76.93,35.96 77.01,36.04 77.01,37.15 76.45,37.7 76.45,39.45 v75.58,40.32 | v65.58,52.47 65.58,56.77 LED6.13
  Bottom 0.254: v75.58,40.32 74.63,41.28 74.63,51.36 73.52,52.47 v65.58,52.47
N$10  (via drill 0.3)
  Top 0.254: R13.2 73.94,28.2 | v67.17,28.18 67.19,28.2 73.94,28.2 | v67.41,25.72 U3.P$24 | 73.94,28.2 74.39,28.65 74.39,32.7 73.76,33.34 73.76,34.69 74.63,35.56 74.63,36.91 73.68,37.86 v73.68,40.48 | v67.96,51.67 67.96,56.85 LED6.14
  Bottom 0.254: v67.17,28.18 67.17,25.96 v67.41,25.72 | v73.68,40.48 73.68,40.64 74.15,41.12 74.15,50.8 73.28,51.67 v67.96,51.67
N$11  (via drill 0.3)
  Top 0.254: U3.P$23 66.14,28.42 67.33,29.61 70.1,29.61 v72.72,32.23 | v71.77,38.26 v71.77,40.24 | v70.9,43.5 70.9,56.45 LED6.15
  Bottom 0.254: v72.72,32.23 72.56,32.23 71.85,32.94 71.85,35.64 71.77,35.72 v71.77,38.26 | v71.77,40.24 71.77,42.62 v70.9,43.5
N$12  (via drill 0.3)
  Top 0.254: LED3.9 75.78,36.55 74.39,37.94 74.39,55.46 LED4.9 | U1.P$9 113.92,43.66 114.71,42.86 114.71,39.37 v114.87,39.21
  Bottom 0.254: v114.87,39.21 107.57,39.21 106.62,40.16 79.41,40.16 LED3.9
N$13  (via drill 0.3)
  Top 0.254: LED3.10 78.3,36.57 76.93,37.94 76.93,55.5 LED4.10 | U1.P$8 113.28,42.39 113.76,41.91 v113.76,38.26
  Bottom 0.254: v113.76,38.26 107.41,38.26 106.14,39.53 81.28,39.53 LED3.10
N$21  (via drill 0.3)
  Top 0.254: LED3.11 80.8,36.61 79.47,37.94 79.47,55.54 LED4.11 | U1.P$7 112.17,41.12 112.81,40.48 v112.81,37.31
  Bottom 0.254: v112.81,37.31 107.25,37.31 105.66,38.89 83.14,38.89 LED3.11
N$24  (via drill 0.3)
  Top 0.254: LED3.12 83.3,36.65 82.01,37.94 82.01,55.58 LED4.12 | U1.P$6 111.38,39.85 111.86,39.37 v111.86,36.35
  Bottom 0.254: v111.86,36.35 107.09,36.35 105.19,38.26 85.01,38.26 LED3.12
N$25  (via drill 0.3)
  Top 0.254: LED3.4 85.82,21.57 v85.82,29.53 85.82,31.59 84.55,32.86 84.55,40.62 LED4.4 | U1.P$5 106.14,38.58 102.49,34.93 v102.49,29.53
  Bottom 0.254: v102.49,29.53 v85.82,29.53
N$27  (via drill 0.3)
  Top 0.254: LED3.3 88.36,21.61 v88.36,30.16 88.36,32.86 87.09,34.13 87.09,40.66 LED4.3 | v103.44,30.16 103.44,34.29 106.46,37.31 U1.P$4
  Bottom 0.254: v103.44,30.16 v88.36,30.16
N$30  (via drill 0.3)
  Top 0.254: LED3.6 80.8,33.24 v80.9,33.34 | v95.66,33.34 95.66,39.85 96.14,40.32 96.14,47.78 v96.46,48.1 | v108.05,46.2 U1.P$11
  Bottom 0.254: v80.9,33.34 v95.66,33.34 | v96.46,48.1 106.14,48.1 v108.05,46.2
N$31  (via drill 0.3)
  Top 0.254: LED3.7 78.3,33.91 v78.36,33.97 | v94.87,33.97 95.03,34.13 95.03,40.01 95.66,40.64 95.66,49.05 v95.98,49.37 | v108.05,47.47 U1.P$12
  Bottom 0.254: v78.36,33.97 v94.87,33.97 | v95.98,49.37 106.14,49.37 v108.05,47.47
N$32  (via drill 0.3)
  Top 0.254: U1.P$18 v97.73,46.2 | v83.28,46.2 83.28,41.89 LED4.5
  Bottom 0.254: v97.73,46.2 v83.28,46.2
N$33  (via drill 0.3)
  Top 0.254: U1.P$21 v97.89,42.39
  Bottom 0.254: v97.89,42.39 96.3,42.39 95.5,43.18 78.68,43.18 78.52,43.02 77.72,43.02 77.57,43.18 77.11,43.18 LED4.8
N$34  (via drill 0.3)
  Top 0.254: U1.P$20 v97.89,43.66 | v78.2,43.66 78.2,41.97 LED4.7
  Bottom 0.254: v97.89,43.66 v78.2,43.66
N$35  (via drill 0.3)
  Top 0.254: LED3.13 85.8,40.14 87.09,41.43 v87.09,47.47 | v97.73,47.47 U1.P$17
  Bottom 0.254: v87.09,47.47 v97.73,47.47
N$36  (via drill 0.3)
  Top 0.254: LED3.14 88.3,40.1 89.47,41.28 v89.47,48.74 | v97.73,48.74 U1.P$16
  Bottom 0.254: v89.47,48.74 v97.73,48.74
N$37  (via drill 0.3)
  Top 0.254: LED3.16 93.3,39.71 94.71,41.12 v94.71,51.12 | v109.95,50.96 U1.P$14
  Bottom 0.254: v94.71,51.12 109.79,51.12 v109.95,50.96
N$43  (via drill 0.3)
  Top 0.254: LED3.15 90.8,40.06 92.01,41.28 v92.01,50.01 | v97.73,50.01 U1.P$15
  Bottom 0.254: v92.01,50.01 v97.73,50.01
N$44  (via drill 0.3)
  Top 0.254: v94.08,34.61 94.55,35.08 94.55,40.32 95.19,40.96 95.19,50.64 95.5,50.96 95.5,51.91 v95.82,52.23 | v108.2,52.23 108.2,49.21 108.68,48.74 U1.P$13 | LED3.8 75.8,24.98 77.57,26.75 v77.57,34.61
  Bottom 0.254: v77.57,34.61 v94.08,34.61 | v95.82,52.23 v108.2,52.23
N$45  (via drill 0.3)
  Top 0.254: LED3.5 83.3,32.52 v83.28,32.54 | v96.3,32.54 96.3,39.85 96.62,40.16 96.62,46.51 v96.93,46.83 | v108.05,44.93 U1.P$10
  Bottom 0.254: v83.28,32.54 v96.3,32.54 | v96.93,46.83 106.14,46.83 v108.05,44.93
N$47
  Top 0.254: R9.1 112.39,50.47 D2.C
N$48  (via drill 0.3)
  Top 0.254: LED4.16 93.3,55.11 v93.28,55.09 | v104.24,55.09 104.24,42.55 102.97,41.28 99.95,41.28 U1.P$22
  Bottom 0.254: v93.28,55.09 v104.24,55.09
N$49  (via drill 0.3)
  Top 0.254: U1.P$19 v97.89,44.93 | v80.74,44.93 80.74,41.93 LED4.6
  Bottom 0.254: v97.89,44.93 v80.74,44.93
N$50  (via drill 0.3)
  Top 0.254: LED3.1 93.3,31.41 v93.28,31.43 93.44,31.59 93.44,32.86 92.17,34.13 92.17,40.48 93.3,41.61 LED4.1 | v105.03,31.43 105.03,33.34 106.46,34.77 U1.P$2 112.01,34.77 115.82,38.58 115.82,39.21 115.35,39.69 115.35,43.18 112.49,46.04 D2.A
  Bottom 0.254: v93.28,31.43 v105.03,31.43
N$55  (via drill 0.3)
  Top 0.254: LED3.2 90.9,21.65 v90.9,30.8 90.9,32.86 89.63,34.13 89.63,40.7 LED4.2 | U1.P$3 106.14,36.04 104.24,34.13 v104.24,30.8
  Bottom 0.254: v104.24,30.8 v90.9,30.8
N$56  (via drill 0.3)
  Top 0.254: LED6.9 55.48,44.43 54.07,43.02 54.07,41.28 55.5,39.85 55.5,36.57 LED5.9 | U3.P$9 v62.33,32.31
  Bottom 0.254: v62.33,32.31 62.33,33.26 61.61,33.97 58.06,33.97 LED5.9
N$57  (via drill 0.3)
  Top 0.254: LED6.10 57.98,44.79 56.69,43.5 56.69,37.84 LED5.10 | U3.P$8 v63.6,32.39
  Bottom 0.254: v63.6,32.39 63.6,33.97 62.96,34.61 59.92,34.61 LED5.10
N$58  (via drill 0.3)
  Top 0.254: LED6.11 60.48,44.83 59.15,43.5 59.15,37.88 LED5.11 | U3.P$7 v64.87,32.31
  Bottom 0.254: v64.87,32.31 64.87,33.73 63.36,35.24 60.82,35.24 60.5,35.56 60.5,36.53 LED5.11
N$59  (via drill 0.3)
  Top 0.254: LED6.12 62.98,44.15 61.77,42.94 61.77,37.76 LED5.12 | U3.P$6 v66.14,32.39
  Bottom 0.254: v66.14,32.39 66.14,33.4 LED5.12
N$60  (via drill 0.3)
  Top 0.254: v67.41,32.31 U3.P$5 66.77,34.77 66.77,37.31 65.48,38.6 LED6.4
  Bottom 0.254: LED5.4 65.48,30.38 v67.41,32.31
N$61  (via drill 0.3)
  Top 0.254: v68.68,32.31 U3.P$4 | LED6.3 67.98,39.47 v66.85,38.34
  Bottom 0.254: LED5.3 67.98,31.61 v68.68,32.31 66.61,34.37 66.61,36.99 66.85,37.23 v66.85,38.34
N$64  (via drill 0.3)
  Top 0.254: U3.P$11 v59.79,32.31
  Bottom 0.254: v59.79,32.31 59.79,22.25 LED5.6
N$65  (via drill 0.3)
  Top 0.254: U3.P$12 v58.52,32.39
  Bottom 0.254: v58.52,32.39 58.52,31.91 57.88,31.27 57.88,21.65 LED5.7
N$66  (via drill 0.3)
  Top 0.254: U3.P$18 59.79,25.08 59.15,25.72 59.15,26.11 58.67,26.59 57.32,26.59 56.61,27.31 56.61,35.96 56.69,36.04 56.69,37.15 56.05,37.78 v56.05,38.58 | v63.04,38.66 63.04,41.81 LED6.5
  Bottom 0.254: v56.05,38.58 56.61,38.58 57.01,38.97 62.72,38.97 v63.04,38.66
N$67  (via drill 0.3)
  Top 0.254: U3.P$21 63.6,31.35 64.23,31.99 v64.23,43.58 | v55.66,43.58 55.66,42.05 LED6.8
  Bottom 0.254: v64.23,43.58 v55.66,43.58
N$68  (via drill 0.3)
  Top 0.254: U3.P$20 62.33,30.96 61.69,31.59 61.69,37.15 61.06,37.78 v61.06,40.32 | v58.04,40.32 58.04,41.81 LED6.7
  Bottom 0.254: v61.06,40.32 v58.04,40.32
N$69  (via drill 0.3)
  Top 0.254: U3.P$17 v58.52,25.72 | v58.52,28.02 v61.69,28.02 | v64.79,28.02 64.79,31.12 65.5,31.83 65.5,36.53 LED5.13
  Bottom 0.254: v58.52,25.72 v58.52,28.02 | v61.69,28.02 v64.79,28.02
N$70  (via drill 0.3)
  Top 0.254: U3.P$16 57.25,25.4 56.53,26.11 55.82,26.11 54.86,27.07 54.86,33.58 v54.94,33.66 | v69.39,45.24 69.39,45.16 69.31,45.09 69.31,40.01 67.96,38.66 67.96,36.57 LED5.14
  Bottom 0.254: v54.94,33.66 54.94,34.85 54.31,35.48 54.31,38.34 53.83,38.81 53.83,40.08 54.31,40.56 54.31,44.69 54.86,45.24 v69.39,45.24
N$71  (via drill 0.3)
  Top 0.254: U3.P$14 55.66,34.13 54.31,35.48 54.31,39.05 v54.71,39.45 | v73.04,39.37 73.04,36.61 LED5.16
  Bottom 0.254: v54.71,39.45 72.96,39.45 v73.04,39.37
N$72  (via drill 0.3)
  Top 0.254: U3.P$15 55.5,23.97 54.23,25.24 54.23,34.29 v53.83,34.69 | v71.85,45.8 71.85,41.35 70.98,40.48 70.98,37.05 LED5.15
  Bottom 0.254: v53.83,34.69 53.83,37.7 53.28,38.26 53.28,40.4 53.83,40.96 53.83,45.24 54.55,45.96 71.69,45.96 v71.85,45.8
N$73  (via drill 0.3)
  Top 0.254: U3.P$13 v57.25,32.31 | v53.51,32.31 53.51,23.52 LED5.8
  Bottom 0.254: v57.25,32.31 v53.51,32.31
N$74  (via drill 0.3)
  Top 0.254: U3.P$10 v61.06,32.23
  Bottom 0.254: v61.06,32.23 61.06,23.48 LED5.5
N$76
  Top 0.254: D3.C R13.1
N$77  (via drill 0.3)
  Top 0.254: U3.P$22 64.87,27.15 65.58,27.86 65.58,29.05 67.33,30.8 68.75,30.8 v69.31,31.35 | v68.91,38.34 68.91,38.74 69.95,39.77 v69.95,40.48 | v72.96,44.61 72.96,56.85 LED6.16
  Bottom 0.254: v69.31,31.35 69.31,37.94 v68.91,38.34 | v69.95,40.48 69.87,40.48 69.15,41.2 69.15,42.94 70.58,44.37 72.72,44.37 v72.96,44.61
N$78  (via drill 0.3)
  Top 0.254: v57.96,38.34 59.15,37.15 59.15,32.15 v59.15,31.59 | v60.02,38.34 60.02,41.41 LED6.6 | U3.P$19 61.06,25.16 v60.42,25.8 | v60.42,29.29 v59.15,29.29
  Bottom 0.254: v57.96,38.34 v60.02,38.34 | v60.42,25.8 v60.42,29.29 | v59.15,29.29 v59.15,31.59
N$79  (via drill 0.3)
  Top 0.254: v71.22,32.31 U3.P$2 71.22,35.08 71.77,35.64 71.77,37.15 72.41,37.78 72.41,39.93 72.98,40.5 LED6.1 | D3.A 74.42,33.86 v74.39,33.89
  Bottom 0.254: LED5.1 72.98,30.54 72.84,30.68 | 72.84,30.68 v71.22,32.31 | v74.39,33.89 74.39,32.23 72.84,30.68
N$80  (via drill 0.3)
  Top 0.254: v69.95,32.39 U3.P$3 69.95,35.16 69.31,35.8 69.31,37.62 70.5,38.81 70.5,41.85 LED6.2
  Bottom 0.254: LED5.2 70.48,31.85 v69.95,32.39
N$81  (via drill 0.3)
  Top 0.254: U4.P$9 v25.5,29.69 | v35.1,29.69 35.1,36.49 LED7.9 36.53,37.92 36.53,42.78 35.16,44.15 LED8.9
  Bottom 0.254: v25.5,29.69 v35.1,29.69
N$82  (via drill 0.3)
  Top 0.254: U4.P$8 v24.23,30.32 | v37.64,30.4 37.64,36.53 LED7.10 38.99,37.88 38.99,42.86 37.66,44.19 LED8.10
  Bottom 0.254: v24.23,30.32 37.56,30.32 v37.64,30.4
N$83  (via drill 0.3)
  Top 0.254: U4.P$7 v22.96,30.96 | v40.1,30.96 40.1,36.49 LED7.11 41.45,37.84 41.45,42.94 40.16,44.23 LED8.11
  Bottom 0.254: v22.96,30.96 v40.1,30.96
N$84  (via drill 0.3)
  Top 0.254: U4.P$6 v21.69,31.59 | v42.64,31.59 42.64,36.53 LED7.12 43.99,37.88 43.99,42.94 42.66,44.27 LED8.12
  Bottom 0.254: v21.69,31.59 v42.64,31.59
N$85  (via drill 0.3)
  Top 0.254: U4.P$5 v20.42,20.88 | LED7.4 45.16,33.95 46.37,35.16 46.37,40.66 LED8.4
  Bottom 0.254: v20.42,20.88 20.89,20.4 44.17,20.4 LED7.4
N$86  (via drill 0.3)
  Top 0.254: U4.P$4 v19.15,20.24 | LED7.3 47.66,34.39 48.91,35.64 48.91,40.62 LED8.3
  Bottom 0.254: v19.15,20.24 19.46,19.92 47.24,19.92 47.64,20.48 47.64,21.53 LED7.3
N$89
  Top 0.254: LED7.6 39.9,21.55 38.12,23.34 36.61,23.34 33.75,26.19 28.83,26.19 28.11,25.48 28.11,24.05 U4.P$11
N$90  (via drill 0.3)
  Top 0.254: LED7.7 37.66,22.2 37.16,22.7 34.39,22.7 33.91,22.23 v33.19,22.23 | v29.31,22.23 U4.P$12
  Bottom 0.254: v33.19,22.23 v29.31,22.23
N$91  (via drill 0.3)
  Top 0.254: U4.P$18 v28.04,39.69
  Bottom 0.254: v28.04,39.69 40.48,39.69 LED8.5
N$92  (via drill 0.3)
  Top 0.254: U4.P$21 v24.23,41.83
  Bottom 0.254: v24.23,41.83 35.12,41.83 LED8.8
N$93  (via drill 0.3)
  Top 0.254: U4.P$20 v25.5,40.96
  Bottom 0.254: v25.5,40.96 33.75,40.96 34.07,40.72 36.51,40.72 LED8.7
N$94  (via drill 0.3)
  Top 0.254: U4.P$17 v29.31,37.78
  Bottom 0.254: v29.31,37.78 43.93,37.78 LED7.13
N$95  (via drill 0.3)
  Top 0.254: U4.P$16 v30.58,38.42
  Bottom 0.254: v30.58,38.42 45.79,38.42 LED7.14
N$96  (via drill 0.3)
  Top 0.254: U4.P$14 v32.88,23.97 | v51.37,24.05 51.37,35.26 LED7.16
  Bottom 0.254: v32.88,23.97 51.29,23.97 v51.37,24.05
N$97  (via drill 0.3)
  Top 0.254: U4.P$15 v31.85,39.05
  Bottom 0.254: v31.85,39.05 47.66,39.05 LED7.15
N$98
  Top 0.254: LED7.8 31.01,21.55 30.58,21.99 U4.P$13
N$99
  Top 0.254: LED7.5 42.2,21.55 40.97,22.78 39.54,22.78 38.35,23.97 36.93,23.97 33.99,26.91 28.19,26.91 26.77,25.48 U4.P$10
N$101
  Top 0.254: D4.C 11.16,30.17 R20.1
N$102  (via drill 0.3)
  Top 0.254: U4.P$22 v22.96,42.55 | v52.48,43.89 52.48,56.69 LED8.16
  Bottom 0.254: v22.96,42.55 32.16,42.55 33.43,43.82 52.4,43.82 v52.48,43.89
N$103  (via drill 0.3)
  Top 0.254: U4.P$19 v26.77,40.32
  Bottom 0.254: v26.77,40.32 38.61,40.32 LED8.6
N$104  (via drill 0.3)
  Top 0.254: v16.61,22.15 U4.P$2 16.61,26.83 15.73,27.7 13.24,27.7 D4.A | LED7.1 52.64,21.57 v52.64,23.34 52.64,34.45 53.83,35.64 53.83,40.7 LED8.1
  Bottom 0.254: v16.61,22.15 27.8,22.15 28.99,23.34 v52.64,23.34
N$105  (via drill 0.3)
  Top 0.254: U4.P$3 v17.88,19.45 | 50.18,21.53 LED7.2 50.16,34.83 51.37,36.04 51.37,40.66 LED8.2
  Bottom 0.254: v17.88,19.45 48.06,19.45 LED7.2
P3V3  (via drill 0.3)  (3 unrouted)
  Top 0.406: U1.P$28 C5.1 98.6,30.8 98.2,30.4 98.2,28.42 v98.12,28.34 | U4.P$28 C7.1 13.11,35.48 v13.59,35.96 | U3.P$28 C6.1 74.87,25.4 v74.71,25.56
  Bottom 0.406: v13.59,35.96 13.59,36.35 | v98.12,28.34 98.12,27.7 | v74.71,25.56 74.71,25.96
  pour Bottom: -4.35,81.12 137.89,81.12 137.89,-11.59 -4.35,-11.59
SCL  (via drill 0.3)
  Top 0.254: U3.P$26 69.95,22.86 69.23,22.15 v69.23,20.4 | v95.42,20.4 95.42,30.64 97.33,32.54 97.33,35.24 98.12,36.04 U1.P$26 | v51.37,20.4 50.9,19.92 31.45,19.92 v30.18,21.19 | v21.21,21.51 21.05,21.67 21.05,30.08 v20.57,30.56 | v17.88,31.91 U4.P$26
  Bottom 0.254: v95.42,20.4 v69.23,20.4 v51.37,20.4 | v30.18,21.19 21.53,21.19 v21.21,21.51 | v20.57,30.56 19.22,30.56 v17.88,31.91
SDA  (via drill 0.3)
  Top 0.254: v96.38,19.76 96.38,30.64 98.04,32.31 98.04,34.37 98.52,34.85 99.71,34.85 U1.P$27 | U3.P$27 71.22,22.78 71.77,22.23 v71.77,19.69 | v52.24,19.69 51.85,19.69 51.45,19.29 31.92,19.29 v31.29,18.65 | v17.24,18.65 17.24,28.73 v16.53,29.45 | v16.53,31.51 16.53,34.05 U4.P$27
  Bottom 0.254: v96.38,19.76 96.3,19.69 v71.77,19.69 v52.24,19.69 | v31.29,18.65 v17.24,18.65 | v16.53,29.45 v16.53,31.51
VCC1  (1 unrouted)